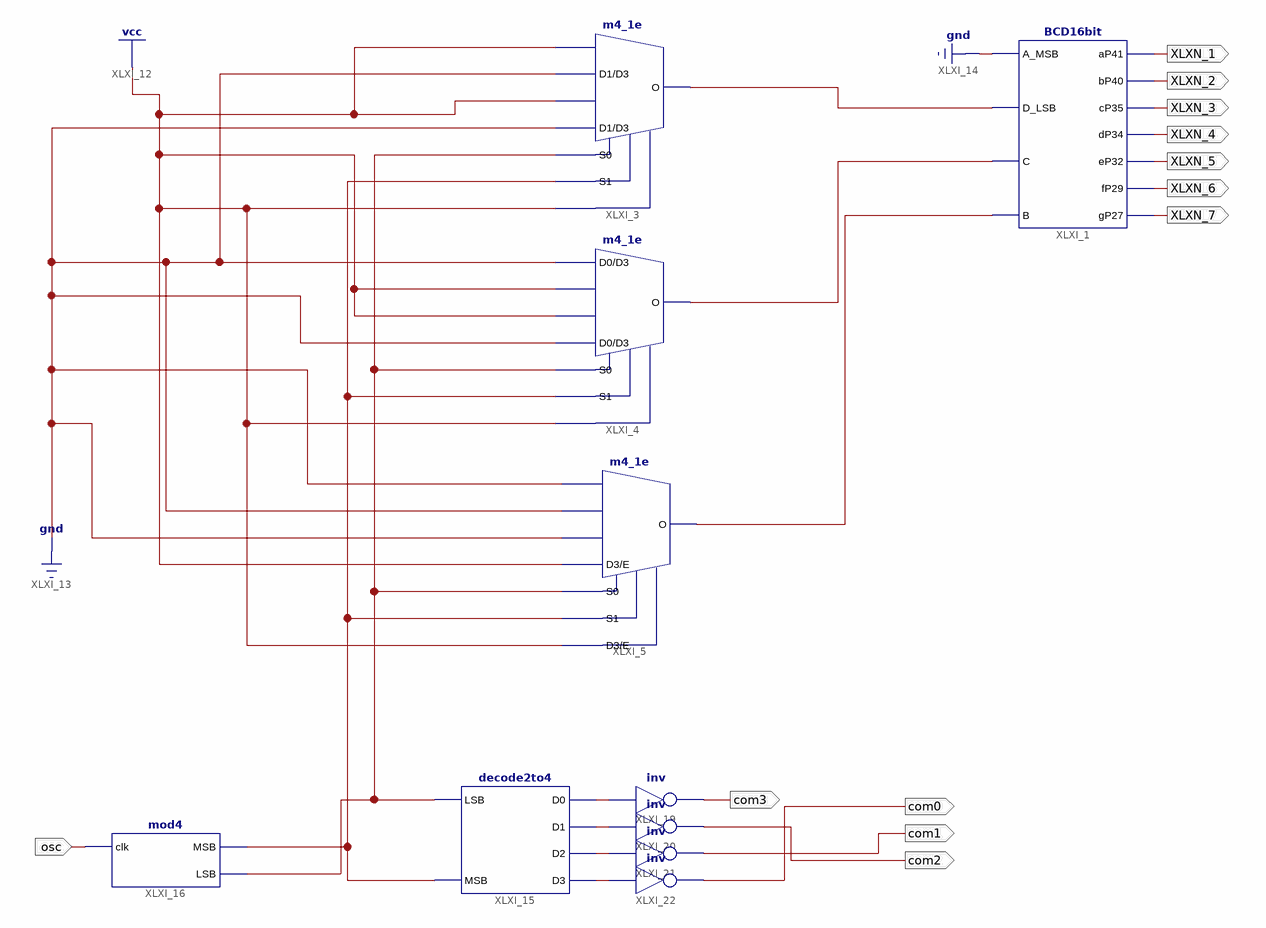
[diagram p0: schematic sheet 1]
// Xilinx ISE schematic testlab1.sch (spartan6) as structural Verilog: 10 symbols, 12 ports
module testlab1 (
  input  osc,
  output XLXN_1,
  output XLXN_2,
  output XLXN_3,
  output XLXN_4,
  output XLXN_5,
  output XLXN_6,
  output XLXN_7,
  output com2,
  output com1,
  output com0,
  output com3
);

  wire XLXN_28, XLXN_29, XLXN_30, XLXN_52, XLXN_54, XLXN_63, XLXN_64, XLXN_65, XLXN_66;

  BCD16bit XLXI_1 (
    .A_MSB(1'b0), .D_LSB(XLXN_28), .C(XLXN_29), .B(XLXN_30), .aP41(XLXN_1), .bP40(XLXN_2), .cP35(XLXN_3),
    .dP34(XLXN_4), .eP32(XLXN_5), .fP29(XLXN_6), .gP27(XLXN_7));
  m4_1e XLXI_4 (.D0(1'b0), .D1(1'b1), .D2(1'b1), .D3(1'b0), .E(1'b1), .S0(XLXN_54), .S1(XLXN_52), .O(XLXN_29));
  m4_1e XLXI_5 (.D0(1'b0), .D1(1'b0), .D2(1'b0), .D3(1'b1), .E(1'b1), .S0(XLXN_54), .S1(XLXN_52), .O(XLXN_30));
  m4_1e XLXI_3 (.D0(1'b1), .D1(1'b0), .D2(1'b1), .D3(1'b0), .E(1'b1), .S0(XLXN_54), .S1(XLXN_52), .O(XLXN_28));
  decode2to4 XLXI_15 (.LSB(XLXN_54), .MSB(XLXN_52), .D0(XLXN_63), .D1(XLXN_64), .D2(XLXN_65), .D3(XLXN_66));
  mod4 XLXI_16 (.clk(osc), .MSB(XLXN_52), .LSB(XLXN_54));
  not XLXI_19 (com3, XLXN_63);
  not XLXI_20 (com2, XLXN_64);
  not XLXI_21 (com1, XLXN_65);
  not XLXI_22 (com0, XLXN_66);
endmodule
